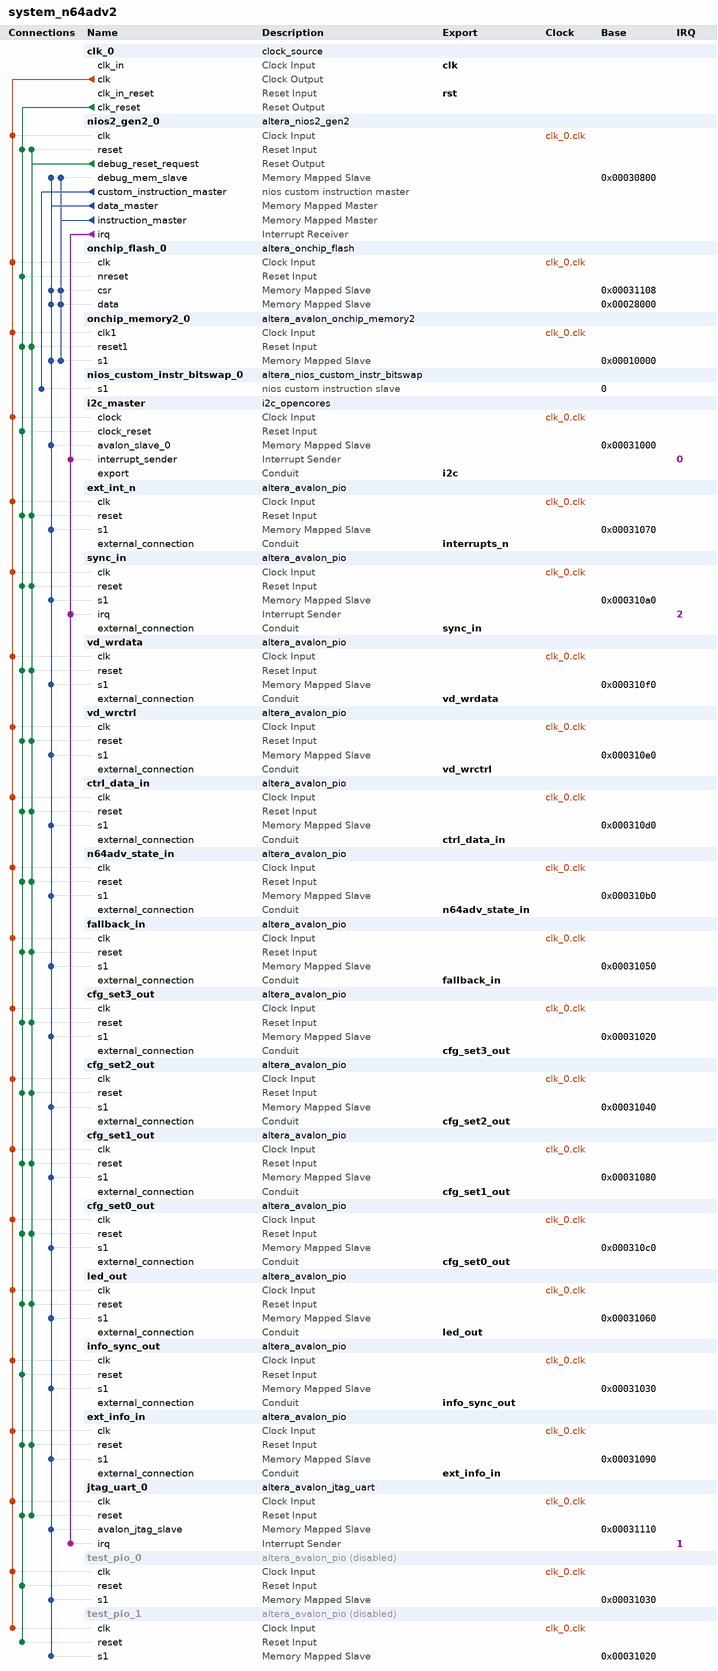
[diagram p0: system contents]
# Platform Designer (Qsys) system system_n64adv2, MAX 10 10M25SAE144C8G
# Parameters at their usual value, and those the tool derives, are not listed.
package require -exact qsys 22.1
create_system system_n64adv2
set_project_property DEVICE_FAMILY {MAX 10}
set_project_property DEVICE 10M25SAE144C8G

add_instance clk_0 clock_source 22.1
set_instance_parameter_value clk_0 clockFrequency 62500000
set_instance_parameter_value clk_0 resetSynchronousEdges BOTH

add_instance nios2_gen2_0 altera_nios2_gen2 22.1
set_instance_parameter_value nios2_gen2_0 dcache_size 2048
set_instance_parameter_value nios2_gen2_0 exceptionSlave onchip_memory2_0.s1
set_instance_parameter_value nios2_gen2_0 icache_size 4096
set_instance_parameter_value nios2_gen2_0 impl Tiny
set_instance_parameter_value nios2_gen2_0 resetSlave onchip_memory2_0.s1

add_instance onchip_flash_0 altera_onchip_flash 22.1
set_instance_parameter_value onchip_flash_0 CLOCK_FREQUENCY 25.0
set_instance_parameter_value onchip_flash_0 CONFIGURATION_MODE {Single Uncompressed Image with Memory Initialization}
set_instance_parameter_value onchip_flash_0 SECTOR_ACCESS_MODE {Read and write,Read and write,Hidden,Hidden,Hidden}
set_instance_parameter_value onchip_flash_0 initFlashContent false
set_instance_parameter_value onchip_flash_0 initializationFileName altera_onchip_flash.hex
set_instance_parameter_value onchip_flash_0 useNonDefaultInitFile false

add_instance onchip_memory2_0 altera_avalon_onchip_memory2 22.1
set_instance_parameter_value onchip_memory2_0 dataWidth 32
set_instance_parameter_value onchip_memory2_0 dualPort false
set_instance_parameter_value onchip_memory2_0 initMemContent true
set_instance_parameter_value onchip_memory2_0 initializationFileName ../nios/software/controller_app/mem_init/system_onchip_memory2_0.hex
set_instance_parameter_value onchip_memory2_0 memorySize 40960
set_instance_parameter_value onchip_memory2_0 useNonDefaultInitFile true

add_instance nios_custom_instr_bitswap_0 altera_nios_custom_instr_bitswap 22.1

add_instance i2c_master i2c_opencores 22.1

add_instance ext_int_n altera_avalon_pio 22.1
set_instance_parameter_value ext_int_n direction Input
set_instance_parameter_value ext_int_n width 2

add_instance sync_in altera_avalon_pio 22.1
set_instance_parameter_value sync_in captureEdge true
set_instance_parameter_value sync_in direction Input
set_instance_parameter_value sync_in generateIRQ true
set_instance_parameter_value sync_in irqType EDGE
set_instance_parameter_value sync_in width 2

add_instance vd_wrdata altera_avalon_pio 22.1
set_instance_parameter_value vd_wrdata direction Output
set_instance_parameter_value vd_wrdata width 20

add_instance vd_wrctrl altera_avalon_pio 22.1
set_instance_parameter_value vd_wrctrl direction Output
set_instance_parameter_value vd_wrctrl width 1

add_instance ctrl_data_in altera_avalon_pio 22.1
set_instance_parameter_value ctrl_data_in direction Input
set_instance_parameter_value ctrl_data_in width 32

add_instance n64adv_state_in altera_avalon_pio 22.1
set_instance_parameter_value n64adv_state_in direction Input
set_instance_parameter_value n64adv_state_in width 29

add_instance fallback_in altera_avalon_pio 22.1
set_instance_parameter_value fallback_in direction Input
set_instance_parameter_value fallback_in width 4

add_instance cfg_set3_out altera_avalon_pio 22.1
set_instance_parameter_value cfg_set3_out direction Output
set_instance_parameter_value cfg_set3_out width 16

add_instance cfg_set2_out altera_avalon_pio 22.1
set_instance_parameter_value cfg_set2_out direction Output
set_instance_parameter_value cfg_set2_out width 32

add_instance cfg_set1_out altera_avalon_pio 22.1
set_instance_parameter_value cfg_set1_out direction Output
set_instance_parameter_value cfg_set1_out width 32

add_instance cfg_set0_out altera_avalon_pio 22.1
set_instance_parameter_value cfg_set0_out direction Output
set_instance_parameter_value cfg_set0_out width 32

add_instance led_out altera_avalon_pio 22.1
set_instance_parameter_value led_out direction Output
set_instance_parameter_value led_out width 2

add_instance info_sync_out altera_avalon_pio 22.1
set_instance_parameter_value info_sync_out captureEdge true
set_instance_parameter_value info_sync_out direction Output
set_instance_parameter_value info_sync_out generateIRQ true
set_instance_parameter_value info_sync_out irqType EDGE
set_instance_parameter_value info_sync_out width 6

add_instance ext_info_in altera_avalon_pio 22.1
set_instance_parameter_value ext_info_in direction Input
set_instance_parameter_value ext_info_in width 32

add_instance jtag_uart_0 altera_avalon_jtag_uart 22.1
set_instance_parameter_value jtag_uart_0 simInteractiveOptions NO_INTERACTIVE_WINDOWS
set_instance_parameter_value jtag_uart_0 useRegistersForReadBuffer true

add_instance test_pio_0 altera_avalon_pio 22.1
set_instance_property test_pio_0 ENABLED false
set_instance_parameter_value test_pio_0 direction Output
set_instance_parameter_value test_pio_0 width 32

add_instance test_pio_1 altera_avalon_pio 22.1
set_instance_property test_pio_1 ENABLED false
set_instance_parameter_value test_pio_1 direction Output
set_instance_parameter_value test_pio_1 width 32

# connections
add_connection clk_0.clk cfg_set0_out.clk clock
add_connection clk_0.clk cfg_set1_out.clk clock
add_connection clk_0.clk cfg_set2_out.clk clock
add_connection clk_0.clk cfg_set3_out.clk clock
add_connection clk_0.clk ctrl_data_in.clk clock
add_connection clk_0.clk ext_info_in.clk clock
add_connection clk_0.clk ext_int_n.clk clock
add_connection clk_0.clk fallback_in.clk clock
add_connection clk_0.clk i2c_master.clock clock
add_connection clk_0.clk info_sync_out.clk clock
add_connection clk_0.clk jtag_uart_0.clk clock
add_connection clk_0.clk led_out.clk clock
add_connection clk_0.clk n64adv_state_in.clk clock
add_connection clk_0.clk nios2_gen2_0.clk clock
add_connection clk_0.clk onchip_flash_0.clk clock
add_connection clk_0.clk onchip_memory2_0.clk1 clock
add_connection clk_0.clk sync_in.clk clock
add_connection clk_0.clk test_pio_0.clk clock
add_connection clk_0.clk test_pio_1.clk clock
add_connection clk_0.clk vd_wrctrl.clk clock
add_connection clk_0.clk vd_wrdata.clk clock
add_connection clk_0.clk_reset cfg_set0_out.reset reset
add_connection clk_0.clk_reset cfg_set1_out.reset reset
add_connection clk_0.clk_reset cfg_set2_out.reset reset
add_connection clk_0.clk_reset cfg_set3_out.reset reset
add_connection clk_0.clk_reset ctrl_data_in.reset reset
add_connection clk_0.clk_reset ext_info_in.reset reset
add_connection clk_0.clk_reset ext_int_n.reset reset
add_connection clk_0.clk_reset fallback_in.reset reset
add_connection clk_0.clk_reset i2c_master.clock_reset reset
add_connection clk_0.clk_reset info_sync_out.reset reset
add_connection clk_0.clk_reset jtag_uart_0.reset reset
add_connection clk_0.clk_reset led_out.reset reset
add_connection clk_0.clk_reset n64adv_state_in.reset reset
add_connection clk_0.clk_reset nios2_gen2_0.reset reset
add_connection clk_0.clk_reset onchip_flash_0.nreset reset
add_connection clk_0.clk_reset onchip_memory2_0.reset1 reset
add_connection clk_0.clk_reset sync_in.reset reset
add_connection clk_0.clk_reset test_pio_0.reset reset
add_connection clk_0.clk_reset test_pio_1.reset reset
add_connection clk_0.clk_reset vd_wrctrl.reset reset
add_connection clk_0.clk_reset vd_wrdata.reset reset
add_connection nios2_gen2_0.debug_reset_request cfg_set0_out.reset reset
add_connection nios2_gen2_0.debug_reset_request cfg_set1_out.reset reset
add_connection nios2_gen2_0.debug_reset_request cfg_set2_out.reset reset
add_connection nios2_gen2_0.debug_reset_request cfg_set3_out.reset reset
add_connection nios2_gen2_0.debug_reset_request ctrl_data_in.reset reset
add_connection nios2_gen2_0.debug_reset_request ext_info_in.reset reset
add_connection nios2_gen2_0.debug_reset_request ext_int_n.reset reset
add_connection nios2_gen2_0.debug_reset_request fallback_in.reset reset
add_connection nios2_gen2_0.debug_reset_request jtag_uart_0.reset reset
add_connection nios2_gen2_0.debug_reset_request led_out.reset reset
add_connection nios2_gen2_0.debug_reset_request n64adv_state_in.reset reset
add_connection nios2_gen2_0.debug_reset_request nios2_gen2_0.reset reset
add_connection nios2_gen2_0.debug_reset_request onchip_memory2_0.reset1 reset
add_connection nios2_gen2_0.debug_reset_request sync_in.reset reset
add_connection nios2_gen2_0.debug_reset_request vd_wrctrl.reset reset
add_connection nios2_gen2_0.debug_reset_request vd_wrdata.reset reset
add_connection nios2_gen2_0.data_master cfg_set0_out.s1 avalon
set_connection_parameter_value nios2_gen2_0.data_master/cfg_set0_out.s1 baseAddress 0x000310c0
add_connection nios2_gen2_0.data_master cfg_set1_out.s1 avalon
set_connection_parameter_value nios2_gen2_0.data_master/cfg_set1_out.s1 baseAddress 0x00031080
add_connection nios2_gen2_0.data_master cfg_set2_out.s1 avalon
set_connection_parameter_value nios2_gen2_0.data_master/cfg_set2_out.s1 baseAddress 0x00031040
add_connection nios2_gen2_0.data_master cfg_set3_out.s1 avalon
set_connection_parameter_value nios2_gen2_0.data_master/cfg_set3_out.s1 baseAddress 0x00031020
add_connection nios2_gen2_0.data_master ctrl_data_in.s1 avalon
set_connection_parameter_value nios2_gen2_0.data_master/ctrl_data_in.s1 baseAddress 0x000310d0
add_connection nios2_gen2_0.data_master ext_info_in.s1 avalon
set_connection_parameter_value nios2_gen2_0.data_master/ext_info_in.s1 baseAddress 0x00031090
add_connection nios2_gen2_0.data_master ext_int_n.s1 avalon
set_connection_parameter_value nios2_gen2_0.data_master/ext_int_n.s1 baseAddress 0x00031070
add_connection nios2_gen2_0.data_master fallback_in.s1 avalon
set_connection_parameter_value nios2_gen2_0.data_master/fallback_in.s1 baseAddress 0x00031050
add_connection nios2_gen2_0.data_master i2c_master.avalon_slave_0 avalon
set_connection_parameter_value nios2_gen2_0.data_master/i2c_master.avalon_slave_0 baseAddress 0x00031000
add_connection nios2_gen2_0.data_master info_sync_out.s1 avalon
set_connection_parameter_value nios2_gen2_0.data_master/info_sync_out.s1 baseAddress 0x00031030
add_connection nios2_gen2_0.data_master jtag_uart_0.avalon_jtag_slave avalon
set_connection_parameter_value nios2_gen2_0.data_master/jtag_uart_0.avalon_jtag_slave baseAddress 0x00031110
add_connection nios2_gen2_0.data_master led_out.s1 avalon
set_connection_parameter_value nios2_gen2_0.data_master/led_out.s1 baseAddress 0x00031060
add_connection nios2_gen2_0.data_master n64adv_state_in.s1 avalon
set_connection_parameter_value nios2_gen2_0.data_master/n64adv_state_in.s1 baseAddress 0x000310b0
add_connection nios2_gen2_0.data_master nios2_gen2_0.debug_mem_slave avalon
set_connection_parameter_value nios2_gen2_0.data_master/nios2_gen2_0.debug_mem_slave baseAddress 0x00030800
add_connection nios2_gen2_0.data_master onchip_flash_0.csr avalon
set_connection_parameter_value nios2_gen2_0.data_master/onchip_flash_0.csr baseAddress 0x00031108
add_connection nios2_gen2_0.data_master onchip_flash_0.data avalon
set_connection_parameter_value nios2_gen2_0.data_master/onchip_flash_0.data baseAddress 0x00028000
add_connection nios2_gen2_0.data_master onchip_memory2_0.s1 avalon
set_connection_parameter_value nios2_gen2_0.data_master/onchip_memory2_0.s1 baseAddress 0x00010000
add_connection nios2_gen2_0.data_master sync_in.s1 avalon
set_connection_parameter_value nios2_gen2_0.data_master/sync_in.s1 baseAddress 0x000310a0
add_connection nios2_gen2_0.data_master test_pio_0.s1 avalon
set_connection_parameter_value nios2_gen2_0.data_master/test_pio_0.s1 baseAddress 0x00031030
add_connection nios2_gen2_0.data_master test_pio_1.s1 avalon
set_connection_parameter_value nios2_gen2_0.data_master/test_pio_1.s1 baseAddress 0x00031020
add_connection nios2_gen2_0.data_master vd_wrctrl.s1 avalon
set_connection_parameter_value nios2_gen2_0.data_master/vd_wrctrl.s1 baseAddress 0x000310e0
add_connection nios2_gen2_0.data_master vd_wrdata.s1 avalon
set_connection_parameter_value nios2_gen2_0.data_master/vd_wrdata.s1 baseAddress 0x000310f0
add_connection nios2_gen2_0.instruction_master nios2_gen2_0.debug_mem_slave avalon
set_connection_parameter_value nios2_gen2_0.instruction_master/nios2_gen2_0.debug_mem_slave baseAddress 0x00030800
add_connection nios2_gen2_0.instruction_master onchip_flash_0.csr avalon
set_connection_parameter_value nios2_gen2_0.instruction_master/onchip_flash_0.csr baseAddress 0x00031108
add_connection nios2_gen2_0.instruction_master onchip_flash_0.data avalon
set_connection_parameter_value nios2_gen2_0.instruction_master/onchip_flash_0.data baseAddress 0x00028000
add_connection nios2_gen2_0.instruction_master onchip_memory2_0.s1 avalon
set_connection_parameter_value nios2_gen2_0.instruction_master/onchip_memory2_0.s1 baseAddress 0x00010000
add_connection nios2_gen2_0.irq i2c_master.interrupt_sender interrupt
set_connection_parameter_value nios2_gen2_0.irq/i2c_master.interrupt_sender irqNumber 0
add_connection nios2_gen2_0.irq jtag_uart_0.irq interrupt
set_connection_parameter_value nios2_gen2_0.irq/jtag_uart_0.irq irqNumber 1
add_connection nios2_gen2_0.irq sync_in.irq interrupt
set_connection_parameter_value nios2_gen2_0.irq/sync_in.irq irqNumber 2
add_connection nios2_gen2_0.custom_instruction_master nios_custom_instr_bitswap_0.s1 nios_custom_instruction
set_connection_parameter_value nios2_gen2_0.custom_instruction_master/nios_custom_instr_bitswap_0.s1 CIName nios_custom_instr_bitswap_0
set_connection_parameter_value nios2_gen2_0.custom_instruction_master/nios_custom_instr_bitswap_0.s1 baseAddress 0

# exported interfaces
add_interface cfg_set0_out conduit end
set_interface_property cfg_set0_out EXPORT_OF cfg_set0_out.external_connection
add_interface cfg_set1_out conduit end
set_interface_property cfg_set1_out EXPORT_OF cfg_set1_out.external_connection
add_interface cfg_set2_out conduit end
set_interface_property cfg_set2_out EXPORT_OF cfg_set2_out.external_connection
add_interface cfg_set3_out conduit end
set_interface_property cfg_set3_out EXPORT_OF cfg_set3_out.external_connection
add_interface clk clock sink
set_interface_property clk EXPORT_OF clk_0.clk_in
add_interface ctrl_data_in conduit end
set_interface_property ctrl_data_in EXPORT_OF ctrl_data_in.external_connection
add_interface ext_info_in conduit end
set_interface_property ext_info_in EXPORT_OF ext_info_in.external_connection
add_interface fallback_in conduit end
set_interface_property fallback_in EXPORT_OF fallback_in.external_connection
add_interface i2c conduit end
set_interface_property i2c EXPORT_OF i2c_master.export
add_interface info_sync_out conduit end
set_interface_property info_sync_out EXPORT_OF info_sync_out.external_connection
add_interface interrupts_n conduit end
set_interface_property interrupts_n EXPORT_OF ext_int_n.external_connection
add_interface led_out conduit end
set_interface_property led_out EXPORT_OF led_out.external_connection
add_interface n64adv_state_in conduit end
set_interface_property n64adv_state_in EXPORT_OF n64adv_state_in.external_connection
add_interface rst reset sink
set_interface_property rst EXPORT_OF clk_0.clk_in_reset
add_interface sync_in conduit end
set_interface_property sync_in EXPORT_OF sync_in.external_connection
add_interface vd_wrctrl conduit end
set_interface_property vd_wrctrl EXPORT_OF vd_wrctrl.external_connection
add_interface vd_wrdata conduit end
set_interface_property vd_wrdata EXPORT_OF vd_wrdata.external_connection

set_interconnect_requirement {$system} qsys_mm.clockCrossingAdapter HANDSHAKE
set_interconnect_requirement {$system} qsys_mm.enableEccProtection FALSE
set_interconnect_requirement {$system} qsys_mm.insertDefaultSlave FALSE
set_interconnect_requirement {$system} qsys_mm.maxAdditionalLatency 1

save_system system_n64adv2.qsys
